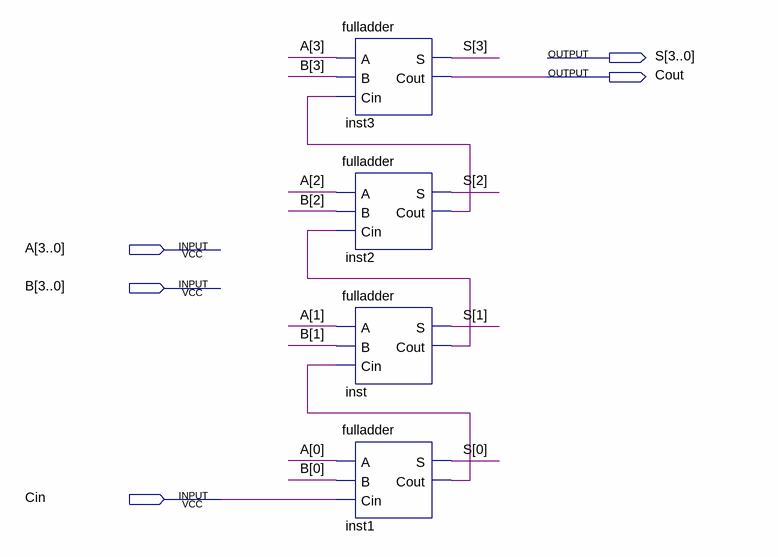
[diagram p0: schematic sheet]
// Quartus schematic adder4.bdf as structural Verilog: 4 symbols, 5 pins
module adder4 (
  input  [3:0] A,
  input  [3:0] B,
  input  Cin,
  output [3:0] S,
  output Cout
);

  wire inst1_cout, inst2_cout, inst_cout;

  fulladder inst3 (.A(A[3]), .B(B[3]), .Cin(inst2_cout), .S(S[3]), .Cout(Cout));
  fulladder inst2 (.A(A[2]), .B(B[2]), .Cin(inst_cout), .S(S[2]), .Cout(inst2_cout));
  fulladder inst (.A(A[1]), .B(B[1]), .Cin(inst1_cout), .S(S[1]), .Cout(inst_cout));
  fulladder inst1 (.A(A[0]), .B(B[0]), .Cin(Cin), .S(S[0]), .Cout(inst1_cout));
endmodule
